# EAGLE design AdapterBoardv0.2 (EAGLE 8.7.1)
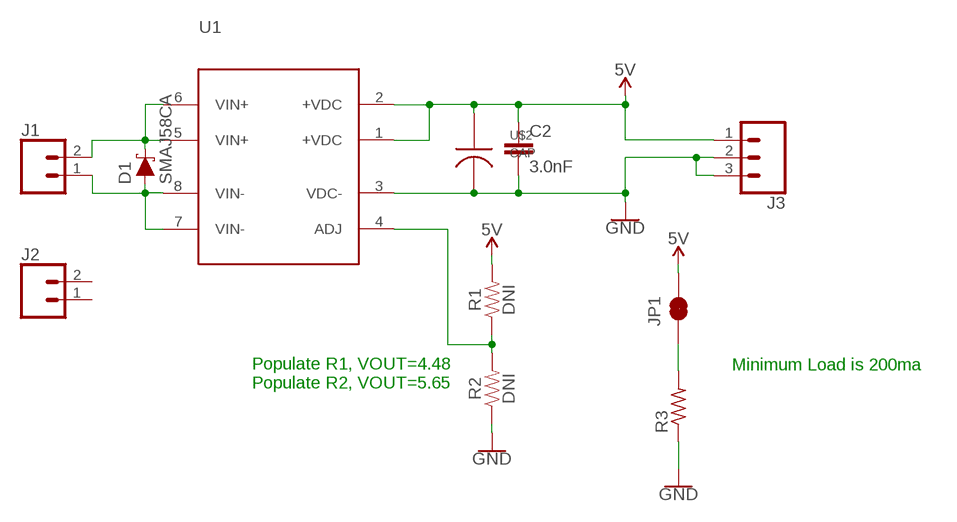
[diagram p0: schematic, sheet 1]

## Parts
C2  3.0nF  3.0NF-0603-50V-5%  [0603]
D1  SMAJ58CA  DIODE-SCHOTTKY-B340A  [SMA-DIODE]
J1  CONN_02  [1X02]
J2  CONN_02  [1X02]
J3  CONN_03  [1X03]
JP1  JUMPER-SMT_2_NC_TRACE_NO-SILK  [SMT-JUMPER_2_NC_TRACE_NO-SILK]
R1  DNI  0.05OHM-0603-1/5W-1%  [0603]
R2  DNI  0.05OHM-0603-1/5W-1%  [0603]
R3  R-US_R1210  [R1210]
U1  PARTICLE_AG9800AG99  [AG9900]
U$2  CAP  [CAP]

## Nets
5V: C2.1 J3.1 JP1.2 R1.2 U1.1(+VDC) U1.2(+VDC) U$2.A
ADJ: R1.1 R2.2 U1.4(ADJ)
GND: C2.2 J3.2 J3.3 R2.1 R3.1 U1.3(VDC-) U$2.C
N$1: JP1.1 R3.2
V+: D1.C J1.2 U1.5(VIN+) U1.6(VIN+)
V-: D1.A J1.1 U1.7(VIN-) U1.8(VIN-)
Unconnected: J2.1 J2.2

## Notes on the sheet
- Minimum Load is 200ma
- Populate R1, VOUT=4.48
  Populate R2, VOUT=5.65

## Library data of the parts
C2 = SparkFun-Capacitors:3.0NF: 3.0nF (3nF, 3000pF) ceramic capacitors A capacitor is a passive two-terminal electrical component used to store electrical energy temporarily in an electric field.; PROD_ID: CAP-13515
D1 = SparkFun-DiscreteSemi:DIODE-SCHOTTKY: Schottky diode A Schottky diode is a semiconductor diode which has a low forward voltage drop and a very fast switching action.; PROD_ID: DIO-09886; VALUE: 3A/40V/500mV
J1 J2 = SparkFun-Connectors:CONN_02: Multi connection point. Often used as Generic Header-pin footprint for 0.1 inch spaced/style header connections On any of the 0.1 inch spaced packages, you can populate with these: Break Away Headers - Straight <https://www.sparkfun.com/products/116> (PRT-00116) Break Away Male Headers - Right Angle <https://www.sparkfun.com/products/553> (PRT-00553) Female Headers <https://www.sparkfun.com/products/115> (PRT-00115) Break Away Headers - Machine Pin <https://www.sparkfun.com/products/117> (PRT-00117) Break Away Female Headers - Swiss Machine Pin <https://www.sparkfun.com/products/743> (PRT-00743) For SCREWTERMINALS and SPRING TERMINALS visit here: Screw Terimnals on SparkFun.com <https://www.sparkfun.com/search/results?term=Screw+Terminals> (5mm/3.5mm/2.54mm spacing) This device is also useful as a general connection point to wire up your design to another part of your project. Our various solder wires solder well into these plated through hole pads. Hook-Up Wire - Assortment (Stranded, 22 AWG) <https://www.sparkfun.com/products/11375> (PRT-11375) Hook-Up Wire - Assortment (Solid Core, 22 AWG) <https://www.sparkfun.com/products/11367> (PRT-11367) View the entire wire category on our website here <https://www.sparkfun.com/categories/141> Special notes: Molex polarized connector foot print use with: PRT-08233 with associated crimp pins and housings. 2.54_SCREWTERM for use with PRT-10571. 3.5mm Screw Terminal footprints for PRT-08084 5mm Screw Terminal footprints for use with PRT-08432
J3 = SparkFun-Connectors:CONN_03: Multi connection point. Often used as Generic Header-pin footprint for 0.1 inch spaced/style header connections On any of the 0.1 inch spaced packages, you can populate with these: Break Away Headers - Straight <https://www.sparkfun.com/products/116> (PRT-00116) Break Away Male Headers - Right Angle <https://www.sparkfun.com/products/553> (PRT-00553) Female Headers <https://www.sparkfun.com/products/115> (PRT-00115) Break Away Headers - Machine Pin <https://www.sparkfun.com/products/117> (PRT-00117) Break Away Female Headers - Swiss Machine Pin <https://www.sparkfun.com/products/743> (PRT-00743) Stackable Header - 3 Pin (Female, 0.1") <https://www.sparkfun.com/products/13875> (PRT-13875) For SCREWTERMINALS and SPRING TERMINALS visit here: Screw Terimnals on SparkFun.com <https://www.sparkfun.com/search/results?term=Screw+Terminals> (5mm/3.5mm/2.54mm spacing) This device is also useful as a general connection point to wire up your design to another part of your project. Our various solder wires solder well into these plated through hole pads. Hook-Up Wire - Assortment (Stranded, 22 AWG) <https://www.sparkfun.com/products/11375> (PRT-11375) Hook-Up Wire - Assortment (Solid Core, 22 AWG) <https://www.sparkfun.com/products/11367> (PRT-11367) View the entire wire category on our website here <https://www.sparkfun.com/categories/141> Special notes: Molex polarized connector foot print use with SKU : PRT-08232 with associated crimp pins and housings.
JP1 = SparkFun-Jumpers:JUMPER-SMT_2_NC_TRACE: Normally closed trace jumper This jumper has a trace between two pads so it's normally closed (NC). Use a razor knife to open the connection. For best results follow the IPC guidelines for cutting traces: Cutout at least 0.063 mm (0.005 in). Remove all loose material to clean up the cut area. Seal the cut with an approved epoxy. Reapply solder to reclose the connection.
R1 R2 = SparkFun-Resistors:0.05OHM: 0.05Ω resistor A resistor is a passive two-terminal electrical component that implements electrical resistance as a circuit element. Resistors act to reduce current flow, and, at the same time, act to lower voltage levels within circuits. - Wikipedia; PROD_ID: RES-12535; VALUE: 0.05
R3 = resistor:R-US_: RESISTOR, American symbol
U1 = AdapterBorad:PARTICLE_AG9800
U$2 = untitled:CAP

## Board
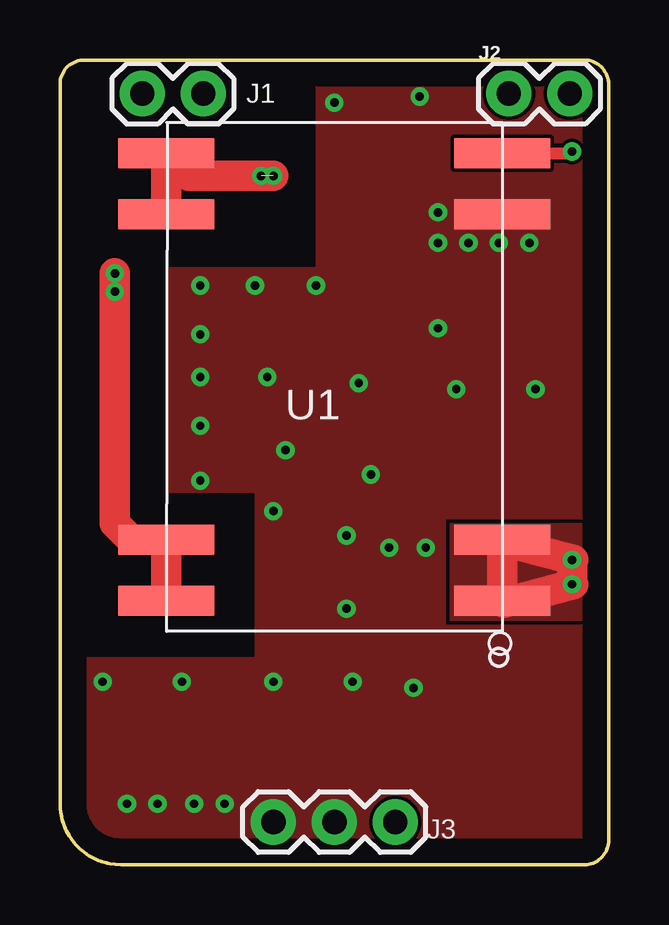
[diagram p1: board, top side]
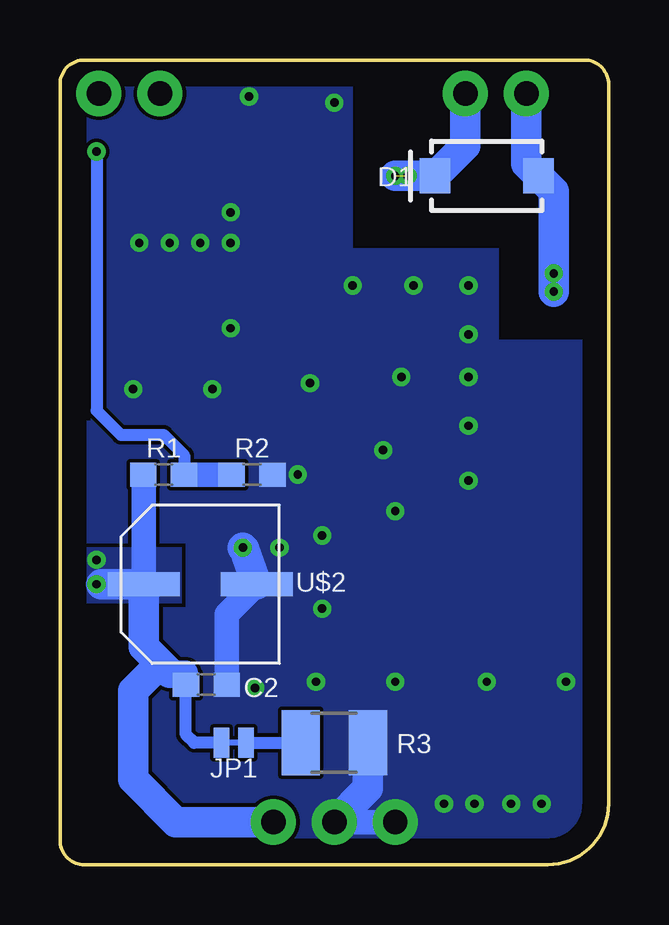
[diagram p2: board, bottom side, seen from below]

Size 22.86 x 33.53 mm. Coordinates in mm from the lower left corner, seen from the top.
Outline: 0,32.51 0,2.54 arc90 2.54,0 21.84,0 arc90 22.86,1.02 22.86,32.51 arc90 21.84,33.53 1.02,33.53 arc90 0,32.51
Copper layers (1*16): Top 0.035mm / dielectric 1.5mm / Bottom 0.035mm
Design rules "default *": minimum track width 6mil, minimum drill 0.35mm, track to track 6mil, track to pad 6mil, pad to pad 6mil, via to via 6mil, smd to smd 6mil, copper to edge 40mil, drill to drill 6mil, minimum pad ring 10mil, minimum via ring 8mil, stop-mask expansion 4mil, vias tented up to drill 0.35mm, thermal gap 10mil

### Footprints (pad centres in the part's own frame; a part is rotated, then mirrored left to right if it is on the bottom)
0603 = smd 1.1 x 1: 1 -0.85,0; 2 0.85,0
SMA-DIODE = smd 1.27 x 1.47: A -2.15,0; C 2.15,0
1X02 = drill 1.016 pad 1.88: 1 0,0; 2 2.54,0
1X03 = drill 1.016 pad 1.88: 1 0,0; 2 2.54,0; 3 5.08,0
SMT-JUMPER_2_NC_TRACE_NO-SILK = smd 0.635 x 1.27: 1 -0.508,0; 2 0.508,0
R1210 = smd 1.6 x 2.7: 1 -1.4,0; 2 1.4,0
AG9900 = smd 1.25 x 4: 1 -9.325,-7; 2 -6.785,-7; 3 6.785,-7; 4 9.325,-7; 5 9.325,7; 6 6.785,7; 7 -6.785,7; 8 -9.325,7
CAP = smd 1 x 3: A 0,2.35; C 0,-2.35

### Placement (x,y rotation side)
C2  16.76,7.49 0 bottom
D1  5.08,28.7 180 bottom
J1  3.43,32.13 0 top
J2  18.7,32.13 0 top
J3  13.97,1.78 180 top
JP1  15.62,5.08 180 bottom
R1  18.54,16.26 180 bottom
R2  14.86,16.26 180 bottom
R3  11.43,5.08 180 bottom
U1  11.43,20.32 90 top
U$2  17.02,11.68 90 bottom

### Tracks (layer width: path | path; a pad name or v marks a point on that pad's centre or on a via)
5V  (via drill 0.35)
  Top 1.27: 21.39,12.7 18.5,13.46 U1.2 U1.1 18.5,10.92 21.39,11.68 | v21.34,12.7 v21.34,11.68
  Bottom 0.508: JP1.2 17.27,5.08 17.61,5.42 C2.1
  Bottom 1.016: R1.2 19.37,16.23 U$2.A 19.5,11.81 | C2.1 17.61,8 18.29,8 19.05,8
  Bottom 1.27: 18.29,8 19.37,9.08 U$2.A 21.13,11.68 | 19.05,8 19.81,7.24 19.81,3.56 18.03,1.78 J3.1
  pour Top (no thermals): 16.26,14.22 21.84,14.22 21.84,10.16 16.26,10.16
  pour Bottom (no thermals): 17.78,13.21 22.1,13.21 22.1,10.92 17.78,10.92
ADJ  (via drill 0.35)
  Top 0.508: U1.4 21.26,29.64 v21.34,29.72
  Bottom 0.508: R1.1 17.69,17.06 18.54,17.91 20.32,17.91 21.34,18.92 v21.34,29.72
  Bottom 1.016: R1.1 R2.2
GND  (via drill 0.35)
  Bottom 1.016: C2.2 15.91,10.44 U$2.C | 10.28,1.78 J3.3 J3.2
  Bottom 1.27: U$2.C 15.18,13.14 v15.24,13.21 | R3.1 10.03,3.18 J3.2
  other vias: 4.06,2.54 6.86,2.54 13.72,13.21 12.95,16.26 19.56,25.91 18.29,25.91 17.02,25.91 15.75,27.18 15.75,25.91 5.84,24.13 5.84,22.1 5.84,20.32 5.84,18.29 5.84,16 14.73,7.37 12.19,7.62 5.08,7.62 1.78,7.62 2.79,2.54 5.59,2.54 8.89,14.73 8.89,7.62 11.94,10.67 11.94,13.72 10.67,24.13 8.13,24.13 8.64,20.32 12.45,20.07 16.51,19.81 19.81,19.81 9.4,17.27 15.75,22.35 11.43,31.75 14.99,32
  pour Top (rank 2, no thermals): 10.67,33.53 21.84,33.53 arc-90 22.86,32.51 22.86,1.02 arc-90 21.84,0 2.54,0 arc-90 0,2.54 0,8.64 8.13,8.64 8.13,15.49 4.57,15.49 4.57,24.89 10.67,24.89
  pour Bottom (rank 2, no thermals): 10.67,33.53 21.84,33.53 arc-90 22.86,32.51 22.86,1.02 arc-90 21.84,0 2.54,0 arc-90 0,2.54 0,21.84 4.57,21.84 4.57,25.65 10.67,25.65
N$1
  Bottom 0.508: JP1.1 R3.2
N$2
  cutout Top: 0.76,33.27 9.4,33.27 9.4,28.19 9.4,25.91 3.81,25.91 3.81,14.48 6.35,14.48 6.86,14.48 6.86,9.91 4.83,9.91 0.76,9.91
N$3
  cutout Bottom: 0.76,33.27 9.4,33.27 9.4,25.91 3.81,25.91 3.81,22.61 0.76,22.61
N$4
  cutout Bottom: 21.84,29.46 22.1,29.46 22.1,27.18 22.1,18.54 21.84,18.54 21.59,18.54 21.59,19.05 21.59,29.46
V+  (via drill 0.35)  (1 unrouted)
  Top 1.27: U1.6 U1.5 5.37,28.7 v8.89,28.7
  Bottom 1.27: J1.2 5.97,29.96 D1.C v8.89,28.7
  other vias: 8.38,28.7
V-  (via drill 0.35)
  Top 1.27: U1.8 U1.7 2.98,13.54 2.29,14.22 v2.29,23.88 v2.29,24.64
  Bottom 1.27: v2.29,23.88 2.29,28.06 D1.A 3.43,29.2 J1.1